# Altium schematic sheet Power_Supply.SchDoc: Power Supply
size A4; CompanyName: St. Cloud State University; Organization: Senior Design Project; Address1: Prosthetic Hand; Address2: Matthew Varas; Address3: Rachel Mertz; Address4: Donnell Jones; DocumentNumber: 5; Revision: 1.1; SheetNumber: 5; SheetTotal: 6
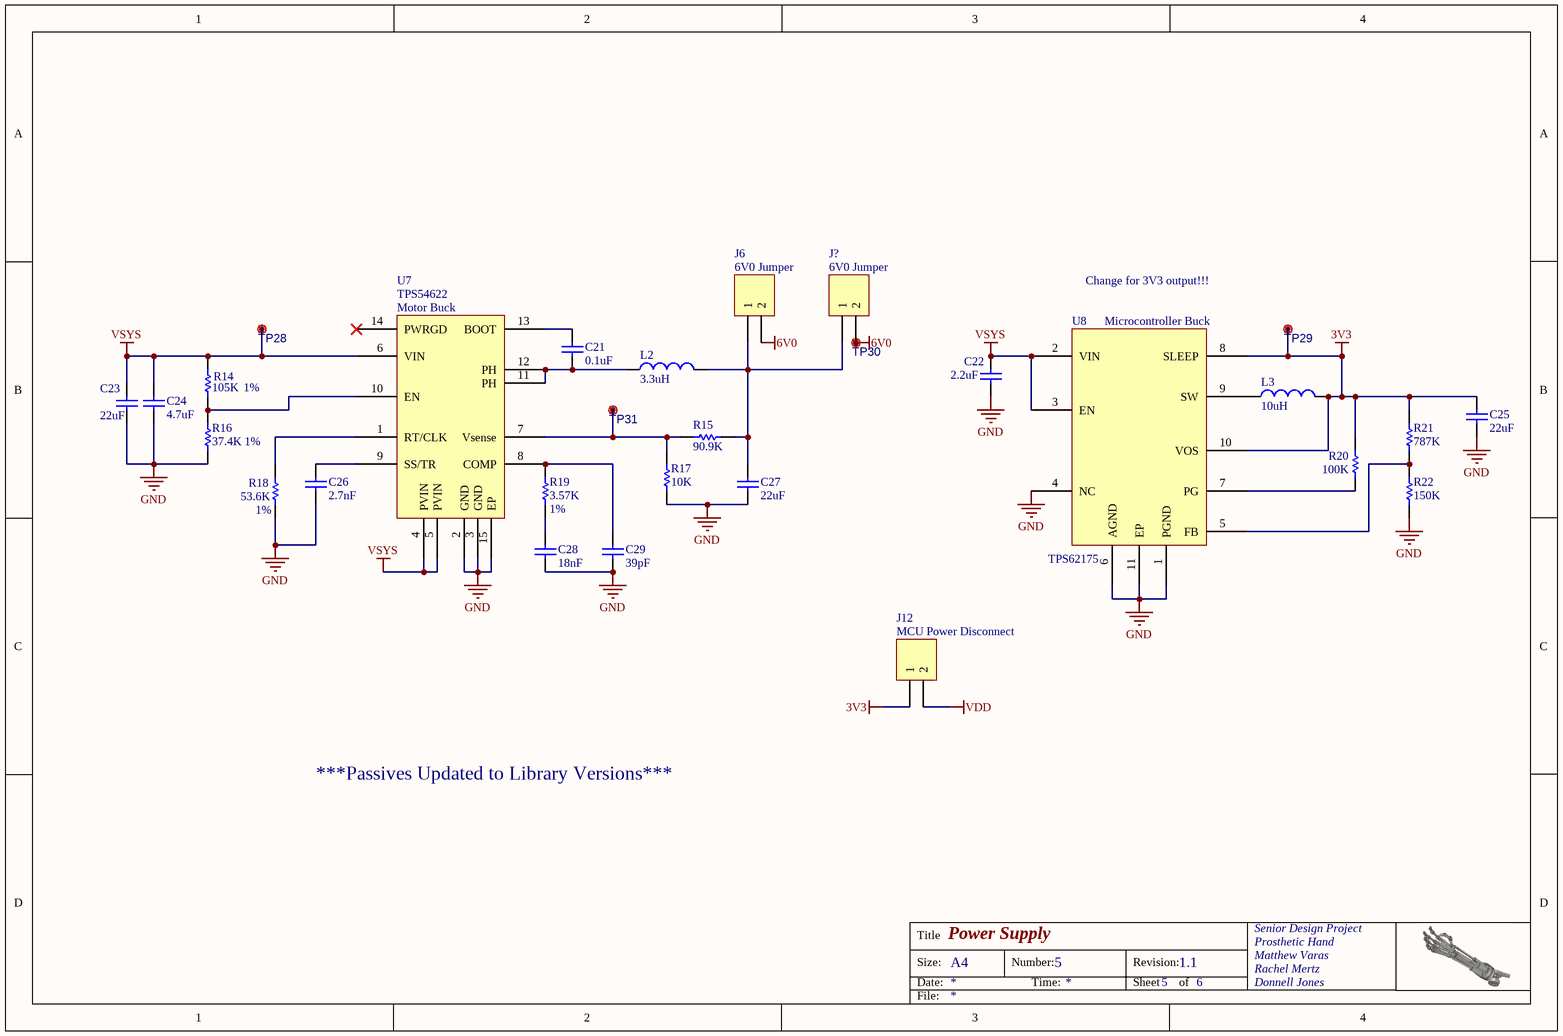
[diagram p0: Power_Supply.SchDoc]

## Parts
C21  value 0.1uF  [0805 Cap]  (hidden comment: Cap)
C22  value 2.2uF  [0603 Cap]  (hidden comment: Cap)
C23  value 22uF  [1206 Cap]  (hidden comment: Cap)
C24  value 4.7uF  [0805 Cap]  (hidden comment: Cap)
C25  value 22uF  [0805 Cap]  (hidden comment: Cap)
C26  value 2.7nF  [0805 Cap]  (hidden comment: Cap)
C27  value 22uF  [1206 Cap]  (hidden comment: Cap)
C28  value 18nF  [0805 Cap]  (hidden comment: Cap)
C29  value 39pF  [0805 Cap]  (hidden comment: Cap)
J6  6V0 Jumper  [HDR1X2]
J12  MCU Power Disconnect  [HDR1X2]
J?  6V0 Jumper  [HDR1X2]
L2  value 3.3uH  [INDM7265X40N]  (hidden comment: Inductor)
L3  value 10uH  [SDR0503]  (hidden comment: Inductor)
R14  value 105K  Tolerance: 1%  [0402 Resistor]  (hidden comment: Resistor)
R15  value 90.9K  [0402 Resistor]  (hidden comment: Resistor)
R16  value 37.4K  Tolerance: 1%  [0402 Resistor]  (hidden comment: Resistor)
R17  value 10K  [0402 Resistor]  (hidden comment: Resistor)
R18  value 53.6K  Tolerance: 1%  [0402 Resistor]  (hidden comment: Resistor)
R19  value 3.57K  Tolerance: 1%  [0402 Resistor]  (hidden comment: Resistor)
R20  value 100K  [0402 Resistor]  (hidden comment: Resistor)
R21  value 787K  [0603 Resistor]  (hidden comment: Resistor)
R22  value 150K  [0603 Resistor]  (hidden comment: Resistor)
TP28  Test Point  [Testpoint_70]  (value not drawn)
TP29  Test Point  [Testpoint_70]  (value not drawn)
TP30  Test Point  [Testpoint_70]  (value not drawn)
TP31  Test Point  [Testpoint_70]  (value not drawn)
U7  TPS54622  Desc: Motor Buck  [S-PVQFN-N14]
U8  TPS62175  Desc: Microcontroller Buck  [R-PWSON-N10]

## Nets
3V3: C25.2 J12.1 L3.2 R20.2 R21.2 TP29.1(M80) U8.8(SLEEP) U8.10(VOS)
6V0: J6.2 J?.2 TP30.1(M80)
GND: C22.1 C23.1 C24.1 C25.1 C26.1 C27.1 C28.1 C29.1 R16.1 R17.1 R18.1 R22.1 U7.2(GND) U7.3(GND) U7.15(EP) U8.1(PGND) U8.4(NC) U8.6(AGND) U8.11(EP)
VDD: J12.2
VSYS: C22.2 C23.2 C24.2 R14.2 TP28.1(M80) U7.4(PVIN) U7.5(PVIN) U7.6(VIN) U8.2(VIN) U8.3(EN)
NetC21_1: C21.1 L2.1 U7.11(PH) U7.12(PH)
NetC21_2: C21.2 U7.13(BOOT)
NetC26_2: C26.2 U7.9(SS/TR)
NetC27_2: C27.2 J6.1 J?.1 L2.2 R15.2
NetC28_2: C28.2 R19.1
NetC29_2: C29.2 R19.2 U7.8(COMP)
NetL3_1: L3.1 U8.9(SW)
NetR14_1: R14.1 R16.2 U7.10(EN)
NetR15_1: R15.1 R17.2 TP31.1(M80) U7.7(Vsense)
NetR18_2: R18.2 U7.1(RT/CLK)
NetR20_1: R20.1 U8.7(PG)
NetR21_1: R21.1 R22.2 U8.5(FB)

Not connected (* = marked no-connect by the designer): U7 14(PWRGD)*

## Notes on the sheet
- Change for 3V3 output!!!
- ***Passives Updated to Library Versions***
- Title
- Size:
- Date:
- A4
- Number:
- Time:
- Revision:
- Sheet
- of
- File:

## Library data of the parts
C21 = Cap 0805: 0.10µF ±10% 25V X7R Ceramic Capacitor 0805; DIGI_PN01: 478-3755-1-ND; MFG_PN01: 08053C104KAT2A; MFG_NAME01: AVX Corporation; Footprint: 0805
C22 = Cap 0603: 2.2µF ±10% 16V X5R Ceramic Capacitor 0603; DIGI_PN01: 490-3296-1-ND; MFG_PN01: GRM188R61C225KE15D; MFG_NAME01: Murata; Footprint: 0603
C23 = Cap 1206: 22µF ±20% 16V X5R Ceramic Capacitor 1206; DIGI_PN01: 490-4739-1-ND; MFG_PN01: GRM31CR61C226ME15L; MFG_NAME01: Murata; Footprint: 1206
C24 = Cap 0805: 4.7µF ±10% 25V X5R Ceramic Capacitor 0805; DIGI_PN01: 490-3335-1-ND; MFG_PN01: GRM21BR61E475KA12L; MFG_NAME01: Murata; Footprint: 0805
C25 = Cap 0805: 22µF ±20% 6.3V X5R Ceramic Capacitor 0805; DIGI_PN01: 490-1719-1-ND; MFG_PN01: GRM21BR60J226ME39L; MFG_NAME01: Murata; Footprint: 0805
C26 = Cap 0805: 2700pF ±10% 50V X7R Ceramic Capacitor 0805; DIGI_PN01: 311-1130-1-ND; MFG_PN01: CC0805KRX7R9BB272; MFG_NAME01: Yageo; Footprint: 0805
C27 = Cap 1206: 22µF ±10% 10V X5R Ceramic Capacitor 1206; DIGI_PN01: 490-6510-1-ND; MFG_PN01: GRM31CR61A226KE19L; MFG_NAME01: Murata; Footprint: 1206
C28 = Cap 0805: 0.018µF ±10% 50V X7R Ceramic Capacitor 0805; DIGI_PN01: 311-1137-1-ND; MFG_PN01: CC0805KRX7R9BB183; MFG_NAME01: Yageo; Footprint: 0805
C29 = Cap 0805: 39pF ±5% 50V C0G, NP0 Ceramic Capacitor 0805; DIGI_PN01: 311-1106-1-ND; MFG_PN01: CC0805JRNPO9BN390; MFG_NAME01: Yageo; Footprint: 0805
J6 J12 J? = Header 2: PEC02SAAN; MFG_NAME01: Sullins Connector Solutions; DIGI_PN01: S1012E-02-ND; MFG_PN01: PEC02SAAN
L2 = Inductor: *; MFG_PN01: SRP6540-3R3M; MFG_NAME01: Bourns Inc.; DIGI_PN01: SRP6540-3R3MCT-ND
L3 = Inductor: FIXED IND 10UH 1.3A 130 MOHM SMD; MFG_PN01: SDR0503-100ML; MFG_NAME01: Bourns Inc.; DIGI_PN01: SDR0503-100MLCT-ND
R14 = Resistor 0402: RES SMD 105K OHM 1% 1/16W 0402; MFG_PN01: CRCW0402105KFKED; MFG_NAME01: Vishay Dale; DIGI_PN01: 541-105KLCT-ND; Footprint: 0402
R15 = Resistor 0402: RES SMD 90.9K OHM 1% 1/16W 0402; MFG_PN01: CRCW040290K9FKED; MFG_NAME01: Vishay Dale; DIGI_PN01: 541-90.9KLCT-ND; Footprint: 0402
R16 = Resistor 0402: RES SMD 37.4K OHM 1% 1/16W 0402; MFG_PN01: CRCW040237K4FKED; MFG_NAME01: Vishay Dale; DIGI_PN01: 541-37.4KLCT-ND; Footprint: 0402
R17 = Resistor 0402: RES SMD 10K OHM 1% 1/16W 0402; MFG_PN01: RC0402FR-0710KL; MFG_NAME01: Yageo; DIGI_PN01: 311-10.0KLRCT-ND; Footprint: 0402; DNP: DNP
R18 = Resistor 0402: RES SMD 53.6K OHM 1% 1/16W 0402; MFG_PN01: CRCW040253K6FKED; MFG_NAME01: Vishay Dale; DIGI_PN01: 541-53.6KLCT-ND; Footprint: 0402
R19 = Resistor 0402: RES SMD 3.57K OHM 1% 1/16W 0402; MFG_PN01: CRCW04023K57FKED; MFG_NAME01: Vishay Dale; DIGI_PN01: 541-3.57KLCT-ND; Footprint: 0402
R20 = Resistor 0402: RES SMD 100K OHM 1% 1/16W 0402; MFG_PN01: CRCW0402100KFKED; MFG_NAME01: Vishay Dale; DIGI_PN01: 541-100KLCT-ND; Footprint: 0402
R21 = Resistor 0603: RES SMD 787K OHM 1% 1/10W 0603; MFG_PN01: RC0603FR-07787KL; MFG_NAME01: Yageo; DIGI_PN01: 311-787KHRCT-ND; Footprint: 0603
R22 = Resistor 0603: RES SMD 150K OHM 0.1% 1/10W 0603; MFG_PN01: RT0603BRD07150KL; MFG_NAME01: Yageo; DIGI_PN01: YAG1532CT-ND; Footprint: 0603
TP28-TP31 = Test Point: Test Pad; MFG_PN01: DNP; MFG_NAME01: DNP; DNP: DNP
U7 = TPS54622: IC REG BUCK ADJ 6A SYNC 14QFN; MFG_PN01: TPS54622RHLR; MFG_NAME01: Texas Instruments; DIGI_PN01: 296-29204-1-ND; Case-EIA: 14-VFQFN
U8 = TPS62175: IC REG BUCK BST 5V 0.8A 10WSON; MFG_NAME01: Texas Instruments; MFG_PN01: TPS62175DQCR; DIGI_PN01: 296-39451-1-ND; Case-EIA: 10-WFDFN